# Altium schematic sheet circuit_etudiant_2025.schdoc
size A4; SheetNumber: 1; SheetTotal: 1; SPICEModelCacheTIKVTHVS: <root> / <DocumentId>TIKVTHVS</DocumentId> / <CacheFrame Number="0"> / <Model Name="ideal" Kind="ckt"> / <Text>.SUBCKT IDEAL 1 2 3 / EGAIN 3 0 1 2 1E5 / .ENDS</Text> / </Model> / </CacheFrame> / </root>
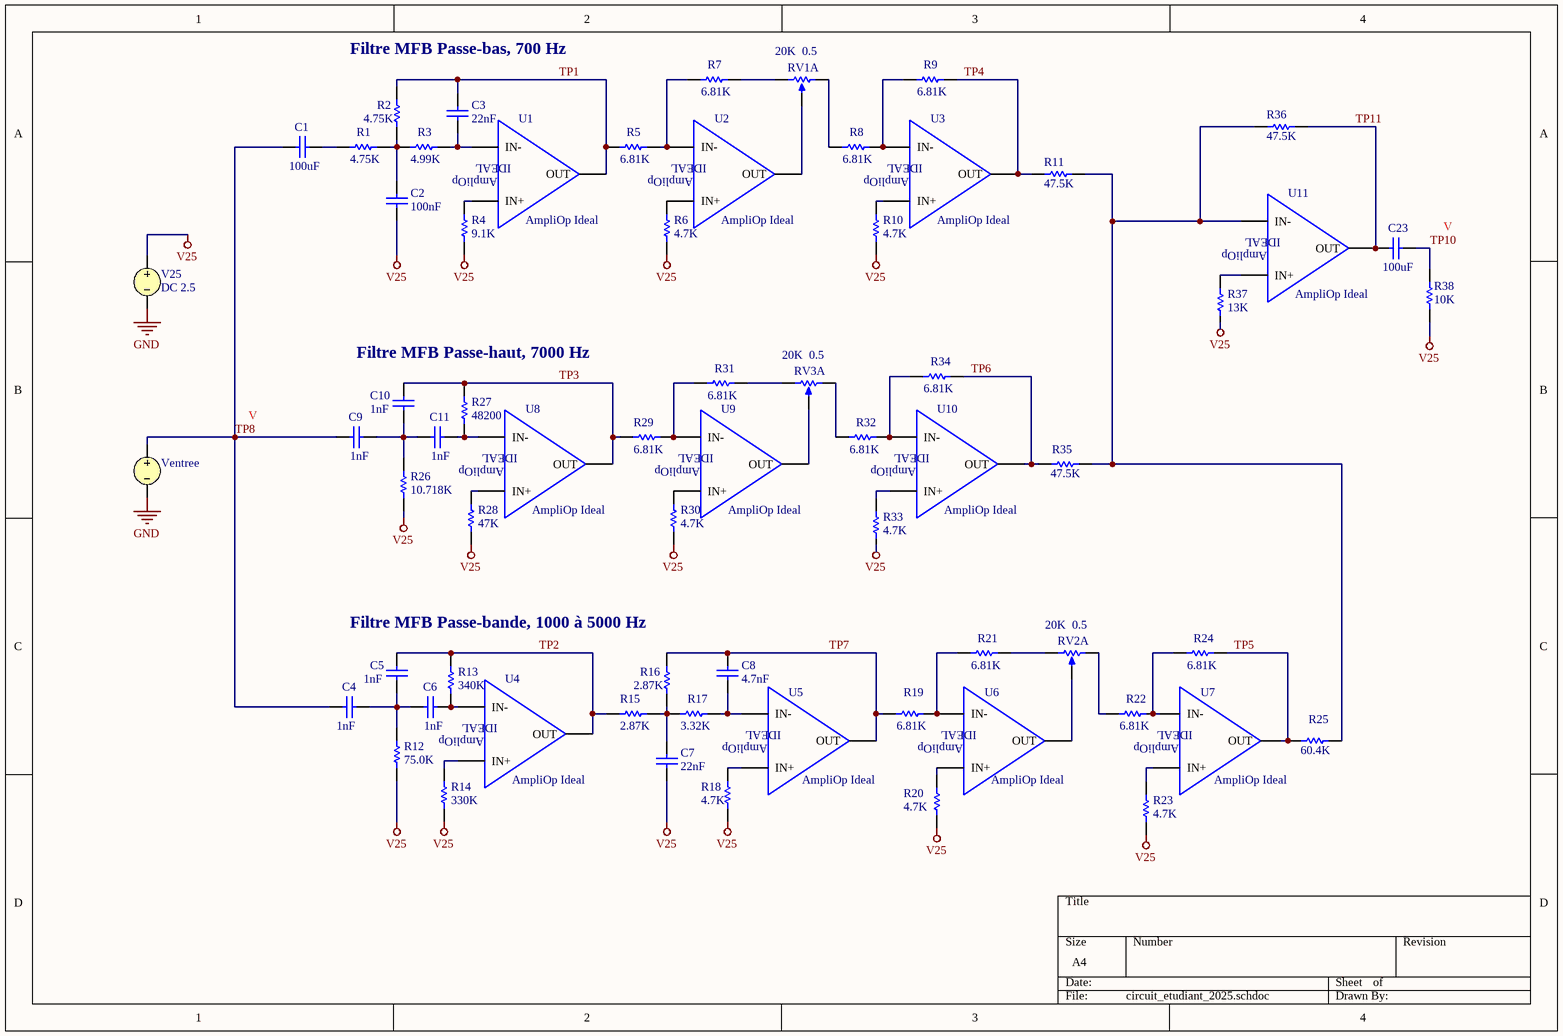
[diagram p0: circuit_etudiant_2025.schdoc]

## Parts
C1  value 100uF  [RAD-0.3]  (hidden comment: Cap)
C2  value 100nF  [RAD-0.3]  (hidden comment: Cap)
C3  value 22nF  [RAD-0.3]  (hidden comment: Cap)
C4  value 1nF  [RAD-0.3]  (hidden comment: Cap)
C5  value 1nF  [RAD-0.3]  (hidden comment: Cap)
C6  value 1nF  [RAD-0.3]  (hidden comment: Cap)
C7  value 22nF  [RAD-0.3]  (hidden comment: Cap)
C8  value 4.7nF  [RAD-0.3]  (hidden comment: Cap)
C9  value 1nF  [RAD-0.3]  (hidden comment: Cap)
C10  value 1nF  [RAD-0.3]  (hidden comment: Cap)
C11  value 1nF  [RAD-0.3]  (hidden comment: Cap)
C23  value 100uF  [RAD-0.3]  (hidden comment: Cap)
R1  value 4.75K  [AXIAL-0.3]  (hidden comment: Res1)
R2  value 4.75K  [AXIAL-0.3]  (hidden comment: Res1)
R3  value 4.99K  [AXIAL-0.3]  (hidden comment: Res1)
R4  value 9.1K  [AXIAL-0.3]  (hidden comment: Res1)
R5  value 6.81K  [AXIAL-0.3]  (hidden comment: Res1)
R6  value 4.7K  [AXIAL-0.3]  (hidden comment: Res1)
R7  value 6.81K  [AXIAL-0.3]  (hidden comment: Res1)
R8  value 6.81K  [AXIAL-0.3]  (hidden comment: Res1)
R9  value 6.81K  [AXIAL-0.3]  (hidden comment: Res1)
R10  value 4.7K  [AXIAL-0.3]  (hidden comment: Res1)
R11  value 47.5K  [AXIAL-0.3]  (hidden comment: Res1)
R12  value 75.0K  [AXIAL-0.3]  (hidden comment: Res1)
R13  value 340K  [AXIAL-0.3]  (hidden comment: Res1)
R14  value 330K  [AXIAL-0.3]  (hidden comment: Res1)
R15  value 2.87K  [AXIAL-0.3]  (hidden comment: Res1)
R16  value 2.87K  [AXIAL-0.3]  (hidden comment: Res1)
R17  value 3.32K  [AXIAL-0.3]  (hidden comment: Res1)
R18  value 4.7K  [AXIAL-0.3]  (hidden comment: Res1)
R19  value 6.81K  [AXIAL-0.3]  (hidden comment: Res1)
R20  value 4.7K  [AXIAL-0.3]  (hidden comment: Res1)
R21  value 6.81K  [AXIAL-0.3]  (hidden comment: Res1)
R22  value 6.81K  [AXIAL-0.3]  (hidden comment: Res1)
R23  value 4.7K  [AXIAL-0.3]  (hidden comment: Res1)
R24  value 6.81K  [AXIAL-0.3]  (hidden comment: Res1)
R25  value 60.4K  [AXIAL-0.3]  (hidden comment: Res1)
R26  value 10.718K  [AXIAL-0.3]  (hidden comment: Res1)
R27  value 48200  [AXIAL-0.3]  (hidden comment: Res1)
R28  value 47K  [AXIAL-0.3]  (hidden comment: Res1)
R29  value 6.81K  [AXIAL-0.3]  (hidden comment: Res1)
R30  value 4.7K  [AXIAL-0.3]  (hidden comment: Res1)
R31  value 6.81K  [AXIAL-0.3]  (hidden comment: Res1)
R32  value 6.81K  [AXIAL-0.3]  (hidden comment: Res1)
R33  value 4.7K  [AXIAL-0.3]  (hidden comment: Res1)
R34  value 6.81K  [AXIAL-0.3]  (hidden comment: Res1)
R35  value 47.5K  [AXIAL-0.3]  (hidden comment: Res1)
R36  value 47.5K  [AXIAL-0.3]  (hidden comment: Res1)
R37  value 13K  [AXIAL-0.3]  (hidden comment: Res1)
R38  value 10K  [AXIAL-0.3]  (hidden comment: Res1)
RV1A  value 20K  Set Position: 0.5  [VR5]  (hidden comment: RPot)
RV2A  value 20K  Set Position: 0.5  [VR5]  (hidden comment: RPot)
RV3A  value 20K  Set Position: 0.5  [VR5]  (hidden comment: RPot)
U1  AmpliOp Ideal
U2  AmpliOp Ideal
U3  AmpliOp Ideal
U4  AmpliOp Ideal
U5  AmpliOp Ideal
U6  AmpliOp Ideal
U7  AmpliOp Ideal
U8  AmpliOp Ideal
U9  AmpliOp Ideal
U10  AmpliOp Ideal
U11  AmpliOp Ideal
V25  DC 2.5
Ventree  SIN(0 1 1Meg 0 0 0)  (value not drawn)

## Nets
GND: V25.2 Ventree.2
V25: C2.2 C7.2 R4.2 R6.2 R10.2 R12.2 R14.2 R18.2 R20.2 R23.2 R26.2 R28.2 R30.2 R33.2 R37.2 R38.1 V25.1
TP1: C3.1 R2.1 R5.1 U1.3(OUT)
TP2: C5.1 R13.1 R15.1 U4.3(OUT)
TP3: C10.1 R27.1 R29.1 U8.3(OUT)
TP4: R9.2 R11.1 U3.3(OUT)
TP5: R24.2 R25.1 U7.3(OUT)
TP6: R34.2 R35.1 U10.3(OUT)
TP7: C8.1 R16.1 R19.1 U5.3(OUT)
TP8: C1.1 C4.1 C9.1 Ventree.1
TP10: C23.2 R38.2
TP11: C23.1 R36.2 U11.3(OUT)
NetC1_2: C1.2 R1.1
NetC2_1: C2.1 R1.2 R2.2 R3.1
NetC3_2: C3.2 R3.2 U1.2(IN-)
NetC4_2: C4.2 C5.2 C6.1 R12.1
NetC6_2: C6.2 R13.2 U4.2(IN-)
NetC7_1: C7.1 R15.2 R16.2 R17.1
NetC8_2: C8.2 R17.2 U5.2(IN-)
NetC9_2: C9.2 C10.2 C11.1 R26.1
NetC11_2: C11.2 R27.2 U8.2(IN-)
NetR4_1: R4.1 U1.1(IN+)
NetR5_2: R5.2 R7.1 U2.2(IN-)
NetR6_1: R6.1 U2.1(IN+)
NetR7_2: R7.2 RV1A.1(TOP)
NetR8_1: R8.1 RV1A.2(BOT)
NetR8_2: R8.2 R9.1 U3.2(IN-)
NetR10_1: R10.1 U3.1(IN+)
NetR11_2: R11.2 R25.2 R35.2 R36.1 U11.2(IN-)
NetR14_1: R14.1 U4.1(IN+)
NetR18_1: R18.1 U5.1(IN+)
NetR19_2: R19.2 R21.1 U6.2(IN-)
NetR20_1: R20.1 U6.1(IN+)
NetR21_2: R21.2 RV2A.1(TOP)
NetR22_1: R22.1 RV2A.2(BOT)
NetR22_2: R22.2 R24.1 U7.2(IN-)
NetR23_1: R23.1 U7.1(IN+)
NetR28_1: R28.1 U8.1(IN+)
NetR29_2: R29.2 R31.1 U9.2(IN-)
NetR30_1: R30.1 U9.1(IN+)
NetR31_2: R31.2 RV3A.1(TOP)
NetR32_1: R32.1 RV3A.2(BOT)
NetR32_2: R32.2 R34.1 U10.2(IN-)
NetR33_1: R33.1 U10.1(IN+)
NetR37_1: R37.1 U11.1(IN+)
NetRV1A_3: RV1A.3(TAP) U2.3(OUT)
NetRV2A_3: RV2A.3(TAP) U6.3(OUT)
NetRV3A_3: RV3A.3(TAP) U9.3(OUT)

## Notes on the sheet
- Filtre MFB Passe-bas, 700 Hz
- Filtre MFB Passe-haut, 7000 Hz
- Filtre MFB Passe-bande, 1000 à 5000 Hz
- (in symbol AmpliOp_ideal) IDEAL; AmpliOp

## Library data of the parts
C1-C11 C23 = Cap: Capacitor; Published: 8-Jun-2000; LatestRevisionDate: 17-Jul-2002; LatestRevisionNote: Re-released for DXP Platform.; PackageReference: RAD-0.3; Publisher: Altium Limited; PackageDescription: Radial Cap, Thru-Hole; 2 Leads; 0.3 in Pin Spacing
R1-R38 = Res1: Resistor; Published: 8-Jun-2000; LatestRevisionDate: 17-Jul-2002; LatestRevisionNote: Re-released for DXP Platform.; PackageReference: AXIAL-0.3; Publisher: Altium Limited; PackageDescription: Axial Device, Thru-Hole; 2 Leads; 0.3 in Pin Spacing
RV1A RV2A RV3A = RPot: Potentiometer; Sim Note: Enter the Resistance value and the set point into parameter fields.; Published: 8-Jun-2000; LatestRevisionDate: 17-Jul-2002; LatestRevisionNote: Re-released for DXP Platform.; PackageReference: VR5; Publisher: Altium Limited; PackageDescription: Variable Resistor, Thru-Hole; 3 Leads
U1-U11 = AmpliOp_ideal
V25 = VSRC: Voltage Source; Note: PCB Footprint - Not required; AC Magnitude: 0; Value: 2.5; Published: 8-Jun-2000; LatestRevisionDate: 17-Jul-2002; LatestRevisionNote: Re-released for DXP Platform.; PackageReference: Not Applicable; Publisher: Altium Limited; AC Phase: 0
Ventree = VSRC: Voltage Source; Note: PCB Footprint - Not required; AC Magnitude: 1; AC Phase: 0; DC Magnitude: 2.5; Published: 8-Jun-2000; LatestRevisionDate: 17-Jul-2002; LatestRevisionNote: Re-released for DXP Platform.; PackageReference: Not Applicable; Publisher: Altium Limited; Offset: 0; Amplitude: 1; Frequency: 1Meg; Delay: 0; Damping Factor: 0; Phase: 0